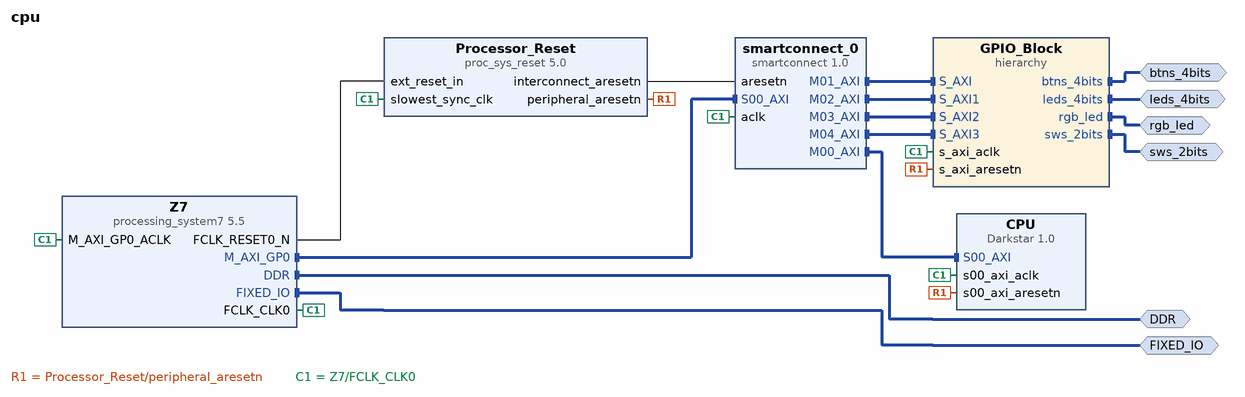
[diagram p0: block diagram of the top level]
# Vivado block design cpu, xc7z020clg400-1, Vivado 2024.2
create_bd_design cpu

create_bd_intf_port -mode Master -vlnv xilinx.com:interface:ddrx_rtl:1.0 DDR
create_bd_intf_port -mode Master -vlnv xilinx.com:display_processing_system7:fixedio_rtl:1.0 FIXED_IO
create_bd_intf_port -mode Master -vlnv xilinx.com:interface:gpio_rtl:1.0 btns_4bits
create_bd_intf_port -mode Master -vlnv xilinx.com:interface:gpio_rtl:1.0 leds_4bits
create_bd_intf_port -mode Master -vlnv xilinx.com:interface:gpio_rtl:1.0 rgb_led
create_bd_intf_port -mode Master -vlnv xilinx.com:interface:gpio_rtl:1.0 sws_2bits

create_bd_cell -type ip -vlnv xilinx.com:ip:processing_system7:5.5 Z7
set_property -dict [list \
  CONFIG.PCW_APU_PERIPHERAL_FREQMHZ 650 \
  CONFIG.PCW_CRYSTAL_PERIPHERAL_FREQMHZ 50 \
  CONFIG.PCW_ENET0_ENET0_IO {MIO 16 .. 27} \
  CONFIG.PCW_ENET0_GRP_MDIO_ENABLE 1 \
  CONFIG.PCW_ENET0_GRP_MDIO_IO {MIO 52 .. 53} \
  CONFIG.PCW_ENET0_PERIPHERAL_ENABLE 1 \
  CONFIG.PCW_ENET0_RESET_ENABLE 1 \
  CONFIG.PCW_ENET0_RESET_IO {MIO 9} \
  CONFIG.PCW_ENET_RESET_ENABLE 1 \
  CONFIG.PCW_ENET_RESET_SELECT {Share reset pin} \
  CONFIG.PCW_FPGA0_PERIPHERAL_FREQMHZ 100 \
  CONFIG.PCW_FPGA1_PERIPHERAL_FREQMHZ 50 \
  CONFIG.PCW_GPIO_MIO_GPIO_ENABLE 1 \
  CONFIG.PCW_GPIO_MIO_GPIO_IO MIO \
  CONFIG.PCW_I2C_RESET_ENABLE 1 \
  CONFIG.PCW_M_AXI_GP0_FREQMHZ 10 \
  CONFIG.PCW_PERIPHERAL_BOARD_PRESET None \
  CONFIG.PCW_PRESET_BANK1_VOLTAGE {LVCMOS 1.8V} \
  CONFIG.PCW_QSPI_GRP_FBCLK_ENABLE 1 \
  CONFIG.PCW_QSPI_GRP_FBCLK_IO {MIO 8} \
  CONFIG.PCW_QSPI_GRP_SINGLE_SS_ENABLE 1 \
  CONFIG.PCW_QSPI_GRP_SINGLE_SS_IO {MIO 1 .. 6} \
  CONFIG.PCW_QSPI_PERIPHERAL_ENABLE 1 \
  CONFIG.PCW_QSPI_QSPI_IO {MIO 1 .. 6} \
  CONFIG.PCW_SD0_GRP_CD_ENABLE 1 \
  CONFIG.PCW_SD0_GRP_CD_IO {MIO 47} \
  CONFIG.PCW_SD0_GRP_WP_ENABLE 0 \
  CONFIG.PCW_SD0_PERIPHERAL_ENABLE 1 \
  CONFIG.PCW_SD0_SD0_IO {MIO 40 .. 45} \
  CONFIG.PCW_SDIO_PERIPHERAL_FREQMHZ 50 \
  CONFIG.PCW_SINGLE_QSPI_DATA_MODE x4 \
  CONFIG.PCW_UART0_PERIPHERAL_ENABLE 1 \
  CONFIG.PCW_UART0_UART0_IO {MIO 14 .. 15} \
  CONFIG.PCW_UART1_PERIPHERAL_ENABLE 0 \
  CONFIG.PCW_UART_PERIPHERAL_FREQMHZ 100 \
  CONFIG.PCW_UIPARAM_DDR_BUS_WIDTH {16 Bit} \
  CONFIG.PCW_UIPARAM_DDR_FREQ_MHZ 525 \
  CONFIG.PCW_UIPARAM_DDR_PARTNO {MT41J256M16 RE-125} \
  CONFIG.PCW_USB0_PERIPHERAL_ENABLE 0 \
  CONFIG.PCW_USB0_RESET_ENABLE 1 \
  CONFIG.PCW_USB0_RESET_IO {MIO 46} \
  CONFIG.PCW_USB_RESET_ENABLE 1 \
  CONFIG.preset None \
] [get_bd_cells Z7]
# 495 more settings of Z7 are not shown: defaults, MIO pin electricals, DDR timing, and values the tool derives
create_bd_cell -type ip -vlnv xilinx.com:ip:proc_sys_reset:5.0 Processor_Reset
create_bd_cell -type hier GPIO_Block
create_bd_cell -type ip -vlnv user.org:user:Darkstar:1.0 CPU
create_bd_cell -type ip -vlnv xilinx.com:ip:smartconnect:1.0 smartconnect_0
set_property -dict {CONFIG.NUM_MI 5 CONFIG.NUM_SI 1} [get_bd_cells smartconnect_0]

# ---- hierarchy /GPIO_Block ----
current_bd_instance /GPIO_Block
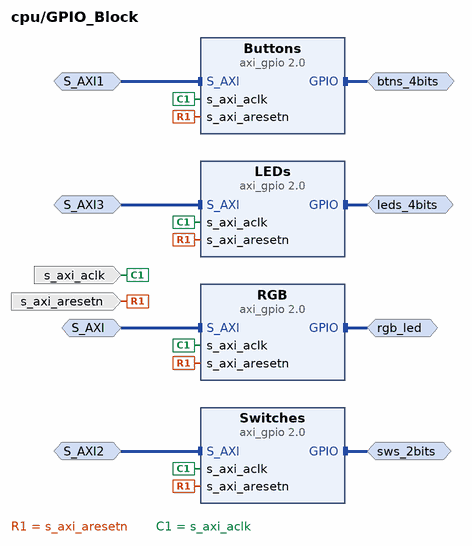
[diagram p1: block diagram inside /GPIO_Block]
create_bd_intf_pin -mode Slave -vlnv xilinx.com:interface:aximm_rtl:1.0 S_AXI
create_bd_intf_pin -mode Master -vlnv xilinx.com:interface:gpio_rtl:1.0 rgb_led
create_bd_intf_pin -mode Slave -vlnv xilinx.com:interface:aximm_rtl:1.0 S_AXI1
create_bd_intf_pin -mode Master -vlnv xilinx.com:interface:gpio_rtl:1.0 btns_4bits
create_bd_intf_pin -mode Slave -vlnv xilinx.com:interface:aximm_rtl:1.0 S_AXI2
create_bd_intf_pin -mode Master -vlnv xilinx.com:interface:gpio_rtl:1.0 sws_2bits
create_bd_intf_pin -mode Slave -vlnv xilinx.com:interface:aximm_rtl:1.0 S_AXI3
create_bd_intf_pin -mode Master -vlnv xilinx.com:interface:gpio_rtl:1.0 leds_4bits
create_bd_pin -dir I -type clk s_axi_aclk
create_bd_pin -dir I -type rst s_axi_aresetn

create_bd_cell -type ip -vlnv xilinx.com:ip:axi_gpio:2.0 RGB
set_property -dict [list \
  CONFIG.C_ALL_OUTPUTS 1 \
  CONFIG.C_GPIO_WIDTH 6 \
  CONFIG.GPIO_BOARD_INTERFACE Custom \
  CONFIG.USE_BOARD_FLOW true \
] [get_bd_cells RGB]
create_bd_cell -type ip -vlnv xilinx.com:ip:axi_gpio:2.0 Buttons
set_property -dict {CONFIG.GPIO_BOARD_INTERFACE Custom CONFIG.USE_BOARD_FLOW false} [get_bd_cells Buttons]
create_bd_cell -type ip -vlnv xilinx.com:ip:axi_gpio:2.0 Switches
set_property -dict {CONFIG.GPIO_BOARD_INTERFACE Custom CONFIG.USE_BOARD_FLOW false} [get_bd_cells Switches]
create_bd_cell -type ip -vlnv xilinx.com:ip:axi_gpio:2.0 LEDs
set_property -dict [list \
  CONFIG.C_ALL_OUTPUTS 1 \
  CONFIG.C_GPIO_WIDTH 4 \
  CONFIG.GPIO_BOARD_INTERFACE Custom \
  CONFIG.USE_BOARD_FLOW true \
] [get_bd_cells LEDs]

# ---- connections ----

current_bd_instance /GPIO_Block
connect_bd_intf_net -intf_net AXI_Interconnect_M01_AXI [get_bd_intf_pins S_AXI1] [get_bd_intf_pins Buttons/S_AXI]
connect_bd_intf_net -intf_net AXI_Interconnect_M02_AXI [get_bd_intf_pins S_AXI3] [get_bd_intf_pins LEDs/S_AXI]
connect_bd_intf_net -intf_net AXI_Interconnect_M03_AXI [get_bd_intf_pins S_AXI] [get_bd_intf_pins RGB/S_AXI]
connect_bd_intf_net -intf_net AXI_Interconnect_M04_AXI [get_bd_intf_pins S_AXI2] [get_bd_intf_pins Switches/S_AXI]
connect_bd_intf_net [get_bd_intf_pins btns_4bits] [get_bd_intf_pins Buttons/GPIO]
connect_bd_intf_net [get_bd_intf_pins leds_4bits] [get_bd_intf_pins LEDs/GPIO]
connect_bd_intf_net [get_bd_intf_pins rgb_led] [get_bd_intf_pins RGB/GPIO]
connect_bd_intf_net [get_bd_intf_pins sws_2bits] [get_bd_intf_pins Switches/GPIO]
connect_bd_net -net proc_sys_reset_0_peripheral_aresetn [get_bd_pins s_axi_aresetn] \
  [get_bd_pins Switches/s_axi_aresetn] [get_bd_pins Buttons/s_axi_aresetn] [get_bd_pins LEDs/s_axi_aresetn] \
  [get_bd_pins RGB/s_axi_aresetn]
connect_bd_net -net processing_system7_0_FCLK_CLK0 [get_bd_pins s_axi_aclk] \
  [get_bd_pins Switches/s_axi_aclk] [get_bd_pins Buttons/s_axi_aclk] [get_bd_pins LEDs/s_axi_aclk] \
  [get_bd_pins RGB/s_axi_aclk]

current_bd_instance /
connect_bd_intf_net -intf_net Buttons_GPIO [get_bd_intf_ports btns_4bits] [get_bd_intf_pins GPIO_Block/btns_4bits]
connect_bd_intf_net -intf_net LEDs_GPIO [get_bd_intf_ports leds_4bits] [get_bd_intf_pins GPIO_Block/leds_4bits]
connect_bd_intf_net -intf_net RGB_GPIO [get_bd_intf_ports rgb_led] [get_bd_intf_pins GPIO_Block/rgb_led]
connect_bd_intf_net -intf_net Switches_GPIO [get_bd_intf_ports sws_2bits] [get_bd_intf_pins GPIO_Block/sws_2bits]
connect_bd_intf_net [get_bd_intf_pins smartconnect_0/S00_AXI] [get_bd_intf_pins Z7/M_AXI_GP0]
connect_bd_intf_net -intf_net processing_system7_0_DDR [get_bd_intf_ports DDR] [get_bd_intf_pins Z7/DDR]
connect_bd_intf_net -intf_net processing_system7_0_FIXED_IO [get_bd_intf_ports FIXED_IO] [get_bd_intf_pins Z7/FIXED_IO]
connect_bd_intf_net [get_bd_intf_pins smartconnect_0/M00_AXI] [get_bd_intf_pins CPU/S00_AXI]
connect_bd_intf_net [get_bd_intf_pins smartconnect_0/M01_AXI] [get_bd_intf_pins GPIO_Block/S_AXI]
connect_bd_intf_net [get_bd_intf_pins smartconnect_0/M02_AXI] [get_bd_intf_pins GPIO_Block/S_AXI1]
connect_bd_intf_net [get_bd_intf_pins smartconnect_0/M03_AXI] [get_bd_intf_pins GPIO_Block/S_AXI2]
connect_bd_intf_net [get_bd_intf_pins smartconnect_0/M04_AXI] [get_bd_intf_pins GPIO_Block/S_AXI3]
connect_bd_net [get_bd_pins Processor_Reset/interconnect_aresetn] [get_bd_pins smartconnect_0/aresetn]
connect_bd_net -net proc_sys_reset_0_peripheral_aresetn [get_bd_pins Processor_Reset/peripheral_aresetn] \
  [get_bd_pins GPIO_Block/s_axi_aresetn] [get_bd_pins CPU/s00_axi_aresetn]
connect_bd_net -net processing_system7_0_FCLK_CLK0 [get_bd_pins Z7/FCLK_CLK0] \
  [get_bd_pins GPIO_Block/s_axi_aclk] [get_bd_pins CPU/s00_axi_aclk] [get_bd_pins Processor_Reset/slowest_sync_clk] \
  [get_bd_pins Z7/M_AXI_GP0_ACLK] [get_bd_pins smartconnect_0/aclk]
connect_bd_net -net processing_system7_0_FCLK_RESET0_N [get_bd_pins Z7/FCLK_RESET0_N] [get_bd_pins Processor_Reset/ext_reset_in]

# ---- address map ----
assign_bd_address -offset 0x41200000 -range 64K -target_address_space [get_bd_addr_spaces Z7/Data] [get_bd_addr_segs GPIO_Block/Buttons/S_AXI/Reg]
assign_bd_address -offset 0x41210000 -range 64K -target_address_space [get_bd_addr_spaces Z7/Data] [get_bd_addr_segs GPIO_Block/LEDs/S_AXI/Reg]
assign_bd_address -offset 0x41220000 -range 64K -target_address_space [get_bd_addr_spaces Z7/Data] [get_bd_addr_segs GPIO_Block/RGB/S_AXI/Reg]
assign_bd_address -offset 0x41230000 -range 64K -target_address_space [get_bd_addr_spaces Z7/Data] [get_bd_addr_segs GPIO_Block/Switches/S_AXI/Reg]
assign_bd_address -offset 0x43C00000 -range 64K -target_address_space [get_bd_addr_spaces Z7/Data] [get_bd_addr_segs CPU/S00_AXI/S00_AXI_reg]

validate_bd_design
save_bd_design
